# Altium project 主控.PrjPcb
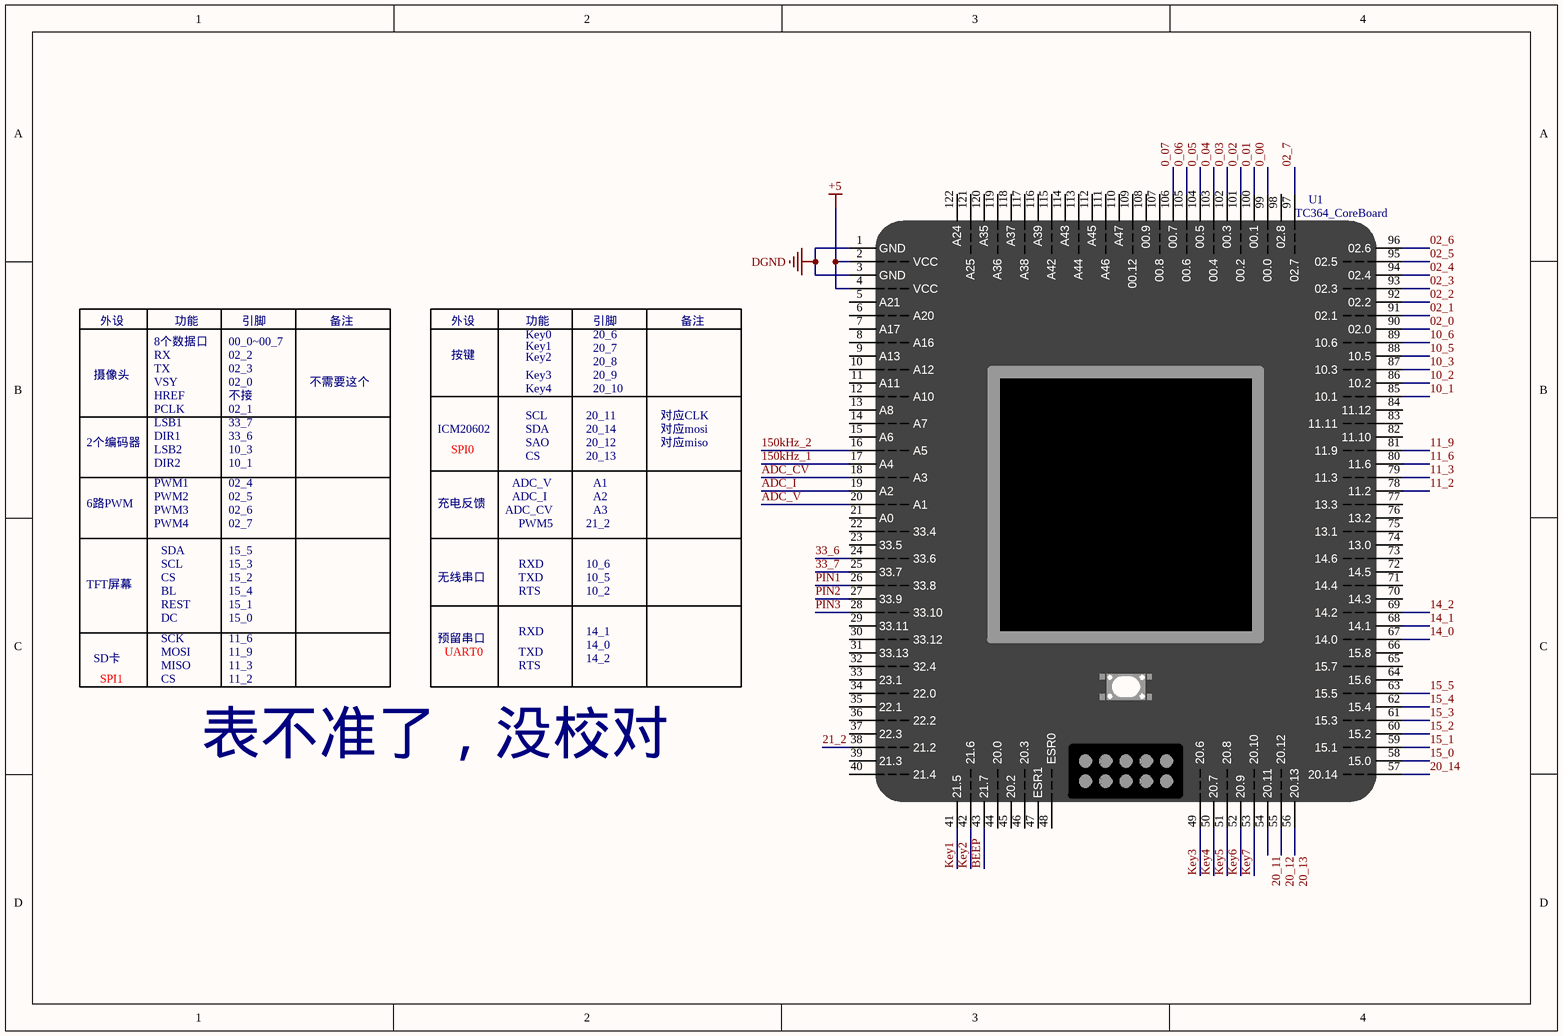
[diagram p0: 主控.SchDoc]
2 sheets, 23 parts. Net scope: global (net labels, ports and power ports of the same name join across sheets).
Board file: 主控.PcbDoc
Sheets:
  主控.SchDoc
  外设1.SchDoc

## Sheet 主控.SchDoc
size A4; DocumentNumber: 1; SheetNumber: 1; SheetTotal: 2

### Parts
U1  TC364_CoreBoard  [TC364_CoreBoard]

### Nets
+5: U1.2(VCC) U1.4(VCC)
DGND: U1.1(GND) U1.3(GND)
0_00: U1.99(00.0)
0_01: U1.100(00.1)
0_02: U1.101(00.2)
0_03: U1.102(00.3)
0_04: U1.103(00.4)
0_05: U1.104(00.5)
0_06: U1.105(00.6)
0_07: U1.106(00.7)
02_0: U1.90(02.0)
02_1: U1.91(02.1)
02_2: U1.92(02.2)
02_3: U1.93(02.3)
02_4: U1.94(02.4)
02_5: U1.95(02.5)
02_6: U1.96(02.6)
02_7: U1.97(02.7)
10_1: U1.85(10.1)
10_2: U1.86(10.2)
10_3: U1.87(10.3)
10_5: U1.88(10.5)
10_6: U1.89(10.6)
11_2: U1.78(11.2)
11_3: U1.79(11.3)
11_6: U1.80(11.6)
11_9: U1.81(11.9)
14_0: U1.67(14.0)
14_1: U1.68(14.1)
14_2: U1.69(14.2)
15_0: U1.58(15.0)
15_1: U1.59(15.1)
15_2: U1.60(15.2)
15_3: U1.61(15.3)
15_4: U1.62(15.4)
15_5: U1.63(15.5)
20_11: U1.54(20.11)
20_12: U1.55(20.12)
20_13: U1.56(20.13)
20_14: U1.57(20.14)
21_2: U1.38(21.2)
33_6: U1.24(33.6)
33_7: U1.25(33.7)
150kHz_1: U1.17(A4)
150kHz_2: U1.16(A5)
ADC_CV: U1.18(A3)
ADC_I: U1.19(A2)
ADC_V: U1.20(A1)
BEEP: U1.43(21.7)
Key1: U1.41(21.5)
Key2: U1.42(21.6)
Key3: U1.49(20.6)
Key4: U1.50(20.7)
Key5: U1.51(20.8)
Key6: U1.52(20.9)
Key7: U1.53(20.10)
PIN1: U1.26(33.8)
PIN2: U1.27(33.9)
PIN3: U1.28(33.10)

Not connected (* = marked no-connect by the designer): U1 5(A21) 6(A20) 7(A17) 8(A16) 9(A13) 10(A12) 11(A11) 12(A10) 13(A8) 14(A7) 15(A6) 21(A0) 22(33.4) 23(33.5) 29(33.11) 30(33.12) 31(33.13) 32(32.4) 33(23.1) 34(22.0) 35(22.1) 36(22.2) 37(22.3) 39(21.3) 40(21.4) 44(20.0) 45(20.2) 46(20.3) 47(ESR1) 48(ESR0) 64(15.6) 65(15.7) 66(15.8) 70(14.3) 71(14.4) 72(14.5) 73(14.6) 74(13.0) 75(13.1) 76(13.2) 77(13.3) 82(11.10) 83(11.11) 84(11.12) 98(02.8) 107(00.8) 108(00.9) 109(00.12) 110(A47) 111(A46) 112(A45) 113(A44) 114(A43) 115(A42) 116(A39) 117(A38) 118(A37) 119(A36) 120(A35) 121(A25) 122(A24)

### Notes on the sheet
- 摄像头
- 外设
- 8个数据口
- RX
- TX
- VSY
- 功能
- 00_0~00_7
- 02_2
- 02_3
- 02_0
- 引脚
- 不需要这个
- 备注
- 按键
- Key0
- Key2
- Key1
- Key3
- 20_9
- 20_8
- 20_7
- 20_6
- 2个编码器
- HREF
- PCLK
- LSB1
- DIR1
- 不接
- 02_1
- 33_7
- 33_6
- ICM20602
- SDA
- SAO
- SCL
- Key4
- 20_11
- 20_14
- 20_12
- 20_10
- 对应CLK
- 对应mosi
- 对应miso
- 6路PWM
- LSB2
- DIR2
- PWM1
- PWM2
- PWM3
- 10_3
- 10_1
- 02_4
- 02_5
- 02_6
- 充电反馈
- SPI0
- ADC_CV
- ADC_V
- ADC_I
- CS
- 20_13
- A1
- A2
- A3
- PWM4
- 15_5
- 15_3
- 15_2
- 02_7
- 无线串口
- PWM5
- TXD
- RXD
- 21_2
- 10_6
- 10_5
- TFT屏幕
- BL
- REST
- DC
- SCK
- MOSI
- 15_4
- 15_1
- 15_0
- 11_6
- 11_9
- 预留串口
- UART0
- RTS
- 10_2
- 14_0
- 14_1
- SD卡
- SPI1
- MISO
- 11_3
- 11_2
- 14_2
- 表不准了，没校对

### Library data of the parts
U1 = TC364_CoreBoard: 逐飞科技TC364核心板

## Sheet 外设1.SchDoc
size A3; DocumentNumber: 2; SheetNumber: 2; SheetTotal: 2
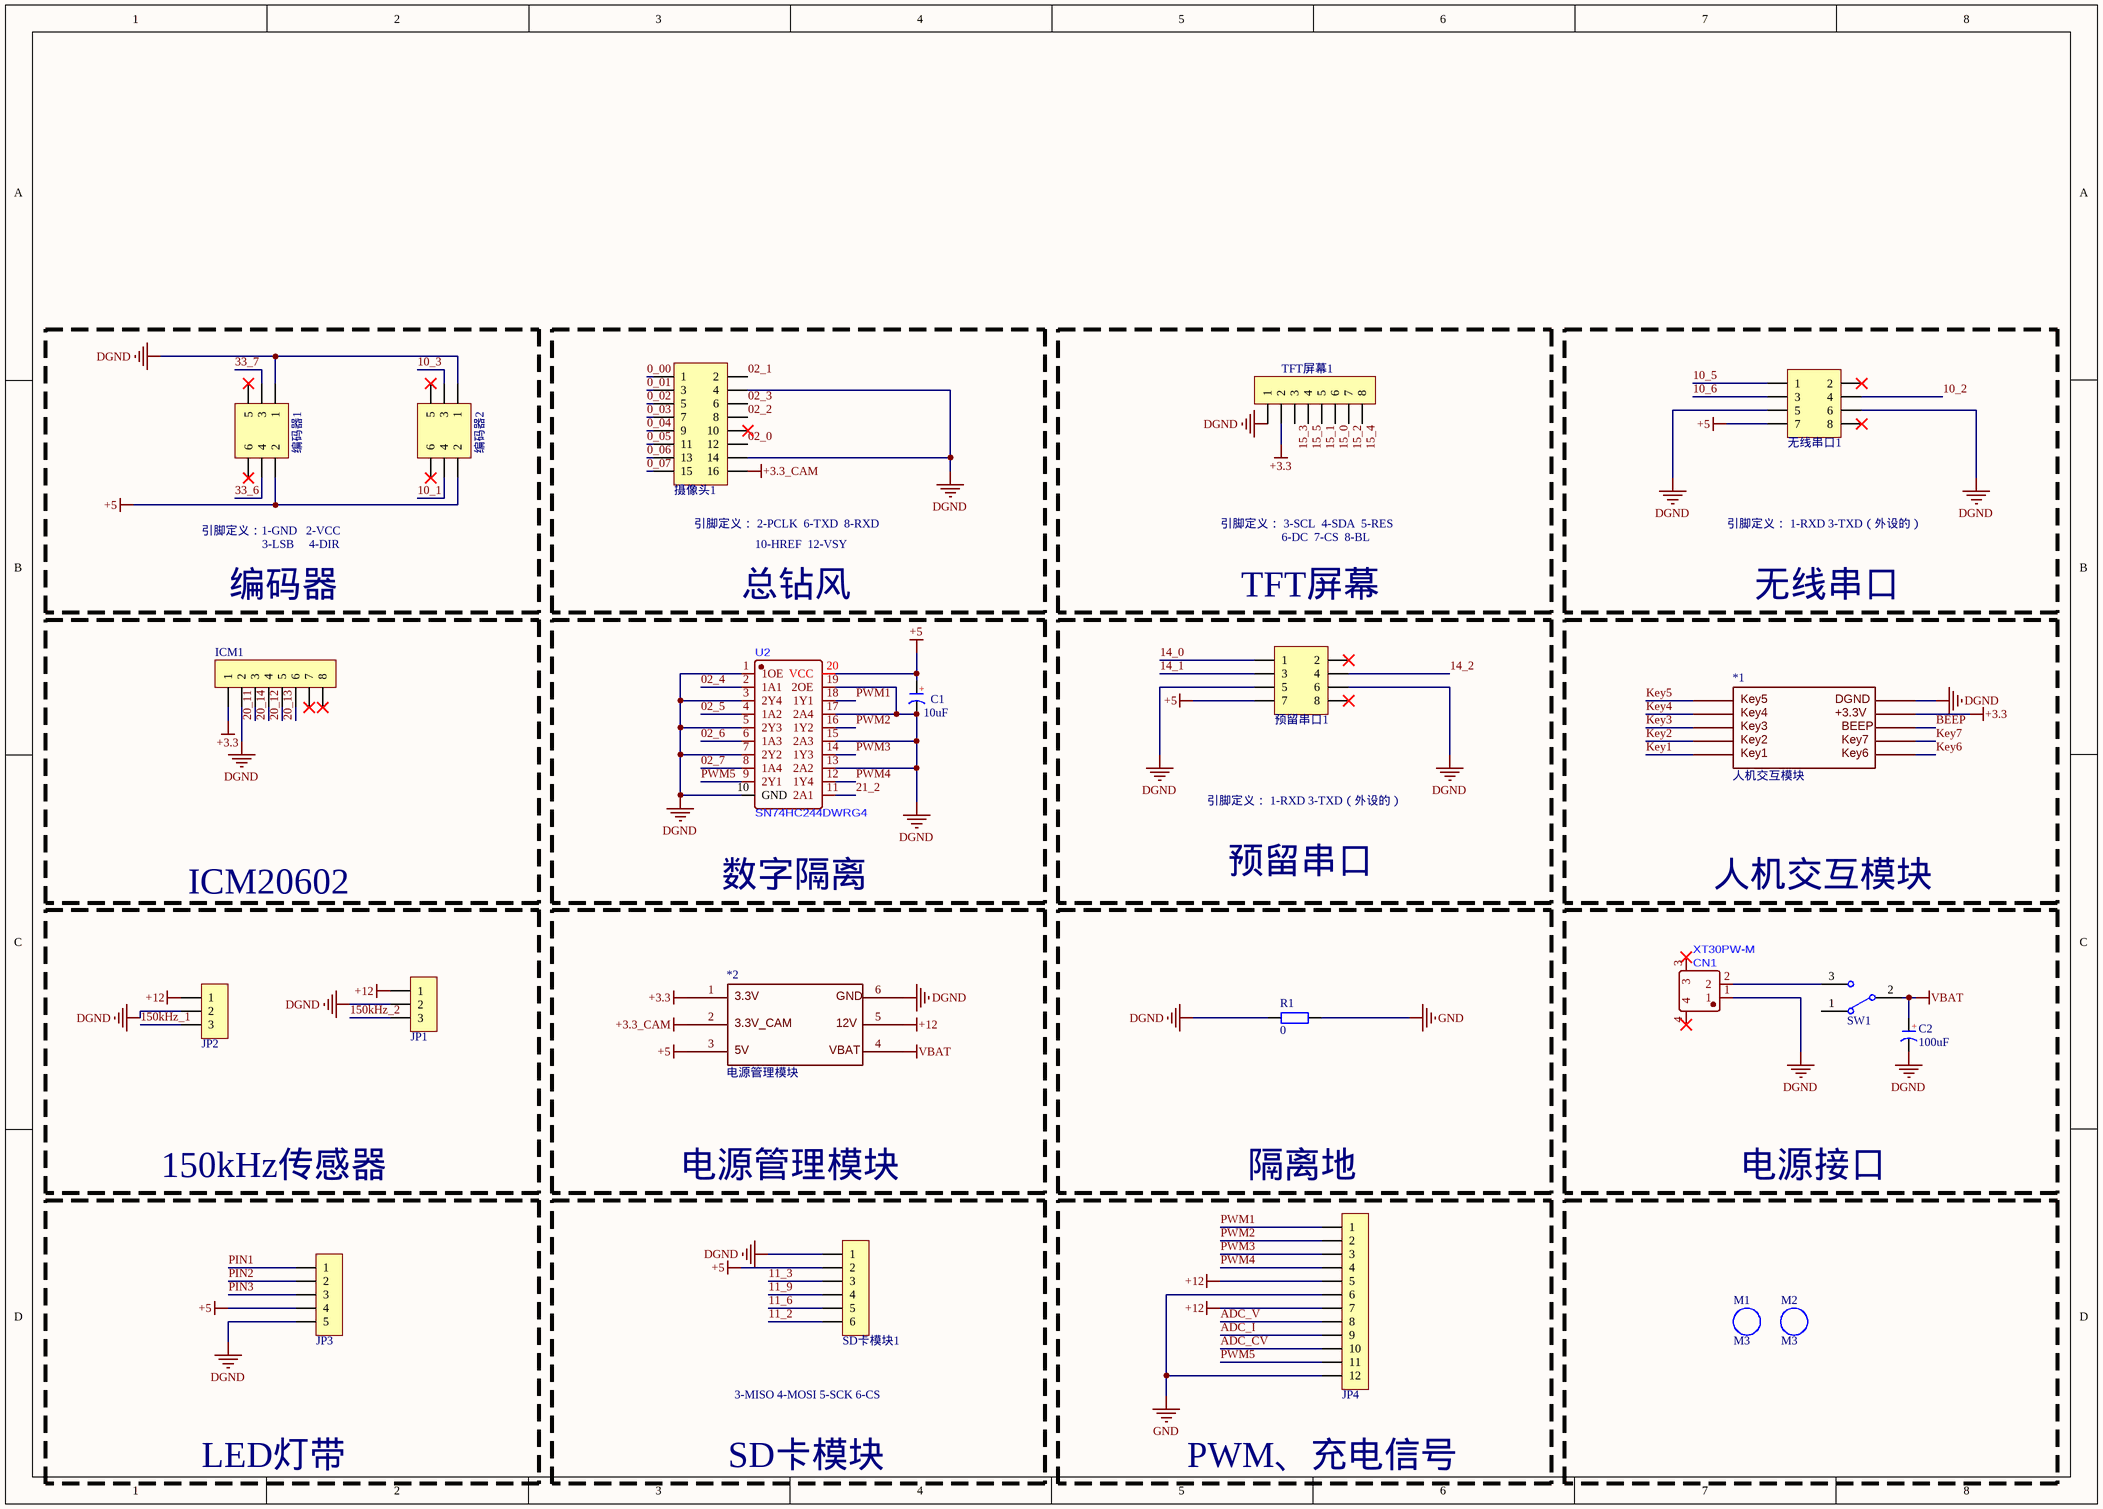
[diagram p1: 外设1.SchDoc]

### Parts
*1  人机交互模块  [PCBComponent_1]
*2  电源管理模块  [PCBComponent_1]
C1  value 10uF  [CD B(3528)]  (hidden comment: C-CD)
C2  value 100uF  [CAP 2.0*5*11-H - GD]  (hidden comment: C-CAP)
CN1  XT30PW-M  [CONN-TH_XT30PW-M]
ICM1  HDR-1X8  [HDR2.54-M-LI-8P]  (value not drawn)
JP1  HDR-1X3  [XH2.54-WI-3P]  (value not drawn)
JP2  HDR-1X3  [XH2.54-WI-3P]  (value not drawn)
JP3  HDR-1X5  [XH2.54-WI-5P]  (value not drawn)
JP4  HDR-1X12  [XH2.54-WI-12P]  (value not drawn)
M1  M3  [M3 125X200]
M2  M3  [M3 125X200]
R1  value 0  [R 1206_L]  (hidden comment: R)
SD卡模块1  HDR-1X6  [HDR2.54-M-LI-6P]  (value not drawn)
SW1  MTS-10x  [MTS-10x]  (value not drawn)
TFT屏幕1  HDR-1X8  [HDR2.54-M-LI-8P]  (value not drawn)
U2  SN74HC244DWRG4  [SOIC-20_L12.8-W7.5-P1.27-LS10.3-BL]
摄像头1  Header 8X2  [HDR2.54-LI-2x8P]  (value not drawn)
无线串口1  Header 4X2  [HDR2.54-LI-2x4P]  (value not drawn)
编码器1  Header3X2  [HDR2.54-LI-2x3P]  (value not drawn)
编码器2  Header3X2  [HDR2.54-LI-2x3P]  (value not drawn)
预留串口1  Header 4X2  [HDR2.54-LI-2x4P]  (value not drawn)

### Blocks framed on the sheet
编码器: 编码器1 编码器2
总钻风: 摄像头1
TFT屏幕: TFT屏幕1
无线串口: 无线串口1
ICM20602: ICM1
数字隔离: C1 U2
预留串口: 预留串口1
人机交互模块: *1
150kHz传感器: JP1 JP2
电源管理模块: *2
隔离地: R1
电源接口: C2 CN1 SW1
LED灯带: JP3
SD卡模块: SD卡模块1
PWM、充电信号: JP4

### Nets
+3.3: *1.9 *2.1 ICM1.1 TFT屏幕1.2
+3.3_CAM: *2.2 摄像头1.16
+5: *2.3 C1.1(A) JP3.4 SD卡模块1.2 U2.20(VCC) 无线串口1.7 编码器1.2 编码器2.2 预留串口1.7
+12: *2.5 JP1.1 JP2.1 JP4.5 JP4.7
DGND: *1.10 *2.6 C1.2(K) C2.2(K) CN1.1 ICM1.2 JP1.2 JP2.2 JP3.5 R1.1 SD卡模块1.1 TFT屏幕1.1 U2.1(1OE) U2.3(2Y4) U2.5(2Y3) U2.7(2Y2) U2.10(GND) U2.13(2A2) U2.15(2A3) U2.17(2A4) U2.19(2OE) 摄像头1.4 摄像头1.14 无线串口1.5 无线串口1.6 编码器1.1 编码器2.1 预留串口1.5 预留串口1.6
GND: JP4.6 JP4.12 R1.2
VBAT: *2.4 C2.1(A) SW1.2
0_00: 摄像头1.1
0_01: 摄像头1.3
0_02: 摄像头1.5
0_03: 摄像头1.7
0_04: 摄像头1.9
0_05: 摄像头1.11
0_06: 摄像头1.13
0_07: 摄像头1.15
02_0: 摄像头1.12
02_1: 摄像头1.2
02_2: 摄像头1.8
02_3: 摄像头1.6
02_4: U2.2(1A1)
02_5: U2.4(1A2)
02_6: U2.6(1A3)
02_7: U2.8(1A4)
10_1: 编码器2.4
10_2: 无线串口1.4
10_3: 编码器2.3
10_5: 无线串口1.1
10_6: 无线串口1.3
11_2: SD卡模块1.6
11_3: SD卡模块1.3
11_6: SD卡模块1.5
11_9: SD卡模块1.4
14_0: 预留串口1.1
14_1: 预留串口1.3
14_2: 预留串口1.4
15_0: TFT屏幕1.6
15_1: TFT屏幕1.5
15_2: TFT屏幕1.7
15_3: TFT屏幕1.3
15_4: TFT屏幕1.8
15_5: TFT屏幕1.4
20_11: ICM1.3
20_12: ICM1.5
20_13: ICM1.6
20_14: ICM1.4
21_2: U2.11(2A1)
33_6: 编码器1.4
33_7: 编码器1.3
150kHz_1: JP2.3
150kHz_2: JP1.3
ADC_CV: JP4.10
ADC_I: JP4.9
ADC_V: JP4.8
BEEP: *1.8
Key1: *1.5
Key2: *1.4
Key3: *1.3
Key4: *1.2
Key5: *1.1
Key6: *1.6
Key7: *1.7
PIN1: JP3.1
PIN2: JP3.2
PIN3: JP3.3
PWM1: JP4.1 U2.18(1Y1)
PWM2: JP4.2 U2.16(1Y2)
PWM3: JP4.3 U2.14(1Y3)
PWM4: JP4.4 U2.12(1Y4)
PWM5: JP4.11 U2.9(2Y1)
NetCN1_2: CN1.2 SW1.3

Not connected (* = marked no-connect by the designer): CN1 3* 4*; ICM1 7* 8*; SW1 1; 摄像头1 10*; 无线串口1 2* 8*; 编码器1 5* 6*; 编码器2 5* 6*; 预留串口1 2* 8*

### Notes on the sheet
- 引脚定义：1-GND   2-VCC
- 3-LSB     4-DIR
- (near 摄像头1) 引脚定义： 2-PCLK  6-TXD  8-RXD
- 10-HREF  12-VSY
- 引脚定义： 3-SCL  4-SDA  5-RES
- 6-DC  7-CS  8-BL
- 引脚定义： 1-RXD 3-TXD（外设的）
- 3-MISO 4-MOSI 5-SCK 6-CS
- (in symbol C-CAP) +
- (in symbol C-CD) +
- (in symbol 人机交互模块) Key5; DGND; Key4; +3.3V; Key3; BEEP; Key2; Key7; Key1; Key6
- (in symbol 电源管理模块) 3.3V; GND; 3.3V_CAM; 12V; 5V; VBAT

### Library data of the parts
C1 = C-CD: 贴片钽电容; 版权归属: 电协硬件组
C2 = C-CAP: 直插电解电容; 版权归属: 电协硬件组
ICM1 TFT屏幕1 = Header 8: 8P接插件; 版权归属: 源创客; BOM名称: 8P接插件; 学习资源: www.ooocke.com
JP1 JP2 = Header 3: 3P接插件; 版权归属: 源创客; BOM名称: 3P接插件; 学习资源: www.ooocke.com
JP3 = Header 5: 5P接插件; 版权归属: 源创客; BOM名称: 5P接插件; 学习资源: www.ooocke.com
JP4 = Header 12: 12P接插件; 版权归属: 源创客; BOM名称: 12P接插件; 学习资源: www.ooocke.com
M1 M2 = M3: 铜柱孔; 版权归属: 电协硬件组
R1 = R: 贴片电阻; 版权归属: 电协硬件组
SD卡模块1 = Header 6: 6P接插件; 版权归属: 源创客; BOM名称: 6P接插件; 学习资源: www.ooocke.com
SW1 = MTS-10x: MTS10x系列3脚扭子开关; 版权归属: 电协硬件组
摄像头1 = Header 8X2: 8*2P接插件; 版权归属: 源创客; BOM名称: 8*2P接插件; 学习资源: www.ooocke.com
无线串口1 预留串口1 = Header 4X2: 4*2P接插件; 版权归属: 源创客; BOM名称: 4*2P接插件; 学习资源: www.ooocke.com
编码器1 编码器2 = Header 3X2: 3*2P接插件; 版权归属: 源创客; BOM名称: 3*2P接插件; 学习资源: www.ooocke.com

## Nets that join several sheets
+5: 主控 (U1.2 U1.4), 外设1 (9 pins)
DGND: 主控 (U1.1 U1.3), 外设1 (29 pins)
0_00: 主控 (U1.99), 外设1 (摄像头1.1)
0_01: 主控 (U1.100), 外设1 (摄像头1.3)
0_02: 主控 (U1.101), 外设1 (摄像头1.5)
0_03: 主控 (U1.102), 外设1 (摄像头1.7)
0_04: 主控 (U1.103), 外设1 (摄像头1.9)
0_05: 主控 (U1.104), 外设1 (摄像头1.11)
0_06: 主控 (U1.105), 外设1 (摄像头1.13)
0_07: 主控 (U1.106), 外设1 (摄像头1.15)
02_0: 主控 (U1.90), 外设1 (摄像头1.12)
02_1: 主控 (U1.91), 外设1 (摄像头1.2)
02_2: 主控 (U1.92), 外设1 (摄像头1.8)
02_3: 主控 (U1.93), 外设1 (摄像头1.6)
02_4: 主控 (U1.94), 外设1 (U2.2)
02_5: 主控 (U1.95), 外设1 (U2.4)
02_6: 主控 (U1.96), 外设1 (U2.6)
02_7: 主控 (U1.97), 外设1 (U2.8)
10_1: 主控 (U1.85), 外设1 (编码器2.4)
10_2: 主控 (U1.86), 外设1 (无线串口1.4)
10_3: 主控 (U1.87), 外设1 (编码器2.3)
10_5: 主控 (U1.88), 外设1 (无线串口1.1)
10_6: 主控 (U1.89), 外设1 (无线串口1.3)
11_2: 主控 (U1.78), 外设1 (SD卡模块1.6)
11_3: 主控 (U1.79), 外设1 (SD卡模块1.3)
11_6: 主控 (U1.80), 外设1 (SD卡模块1.5)
11_9: 主控 (U1.81), 外设1 (SD卡模块1.4)
14_0: 主控 (U1.67), 外设1 (预留串口1.1)
14_1: 主控 (U1.68), 外设1 (预留串口1.3)
14_2: 主控 (U1.69), 外设1 (预留串口1.4)
15_0: 主控 (U1.58), 外设1 (TFT屏幕1.6)
15_1: 主控 (U1.59), 外设1 (TFT屏幕1.5)
15_2: 主控 (U1.60), 外设1 (TFT屏幕1.7)
15_3: 主控 (U1.61), 外设1 (TFT屏幕1.3)
15_4: 主控 (U1.62), 外设1 (TFT屏幕1.8)
15_5: 主控 (U1.63), 外设1 (TFT屏幕1.4)
20_11: 主控 (U1.54), 外设1 (ICM1.3)
20_12: 主控 (U1.55), 外设1 (ICM1.5)
20_13: 主控 (U1.56), 外设1 (ICM1.6)
20_14: 主控 (U1.57), 外设1 (ICM1.4)
21_2: 主控 (U1.38), 外设1 (U2.11)
33_6: 主控 (U1.24), 外设1 (编码器1.4)
33_7: 主控 (U1.25), 外设1 (编码器1.3)
150kHz_1: 主控 (U1.17), 外设1 (JP2.3)
150kHz_2: 主控 (U1.16), 外设1 (JP1.3)
ADC_CV: 主控 (U1.18), 外设1 (JP4.10)
ADC_I: 主控 (U1.19), 外设1 (JP4.9)
ADC_V: 主控 (U1.20), 外设1 (JP4.8)
BEEP: 主控 (U1.43), 外设1 (*1.8)
Key1: 主控 (U1.41), 外设1 (*1.5)
Key2: 主控 (U1.42), 外设1 (*1.4)
Key3: 主控 (U1.49), 外设1 (*1.3)
Key4: 主控 (U1.50), 外设1 (*1.2)
Key5: 主控 (U1.51), 外设1 (*1.1)
Key6: 主控 (U1.52), 外设1 (*1.6)
Key7: 主控 (U1.53), 外设1 (*1.7)
PIN1: 主控 (U1.26), 外设1 (JP3.1)
PIN2: 主控 (U1.27), 外设1 (JP3.2)
PIN3: 主控 (U1.28), 外设1 (JP3.3)